# Altium schematic sheet Supplies.SchDoc
size C
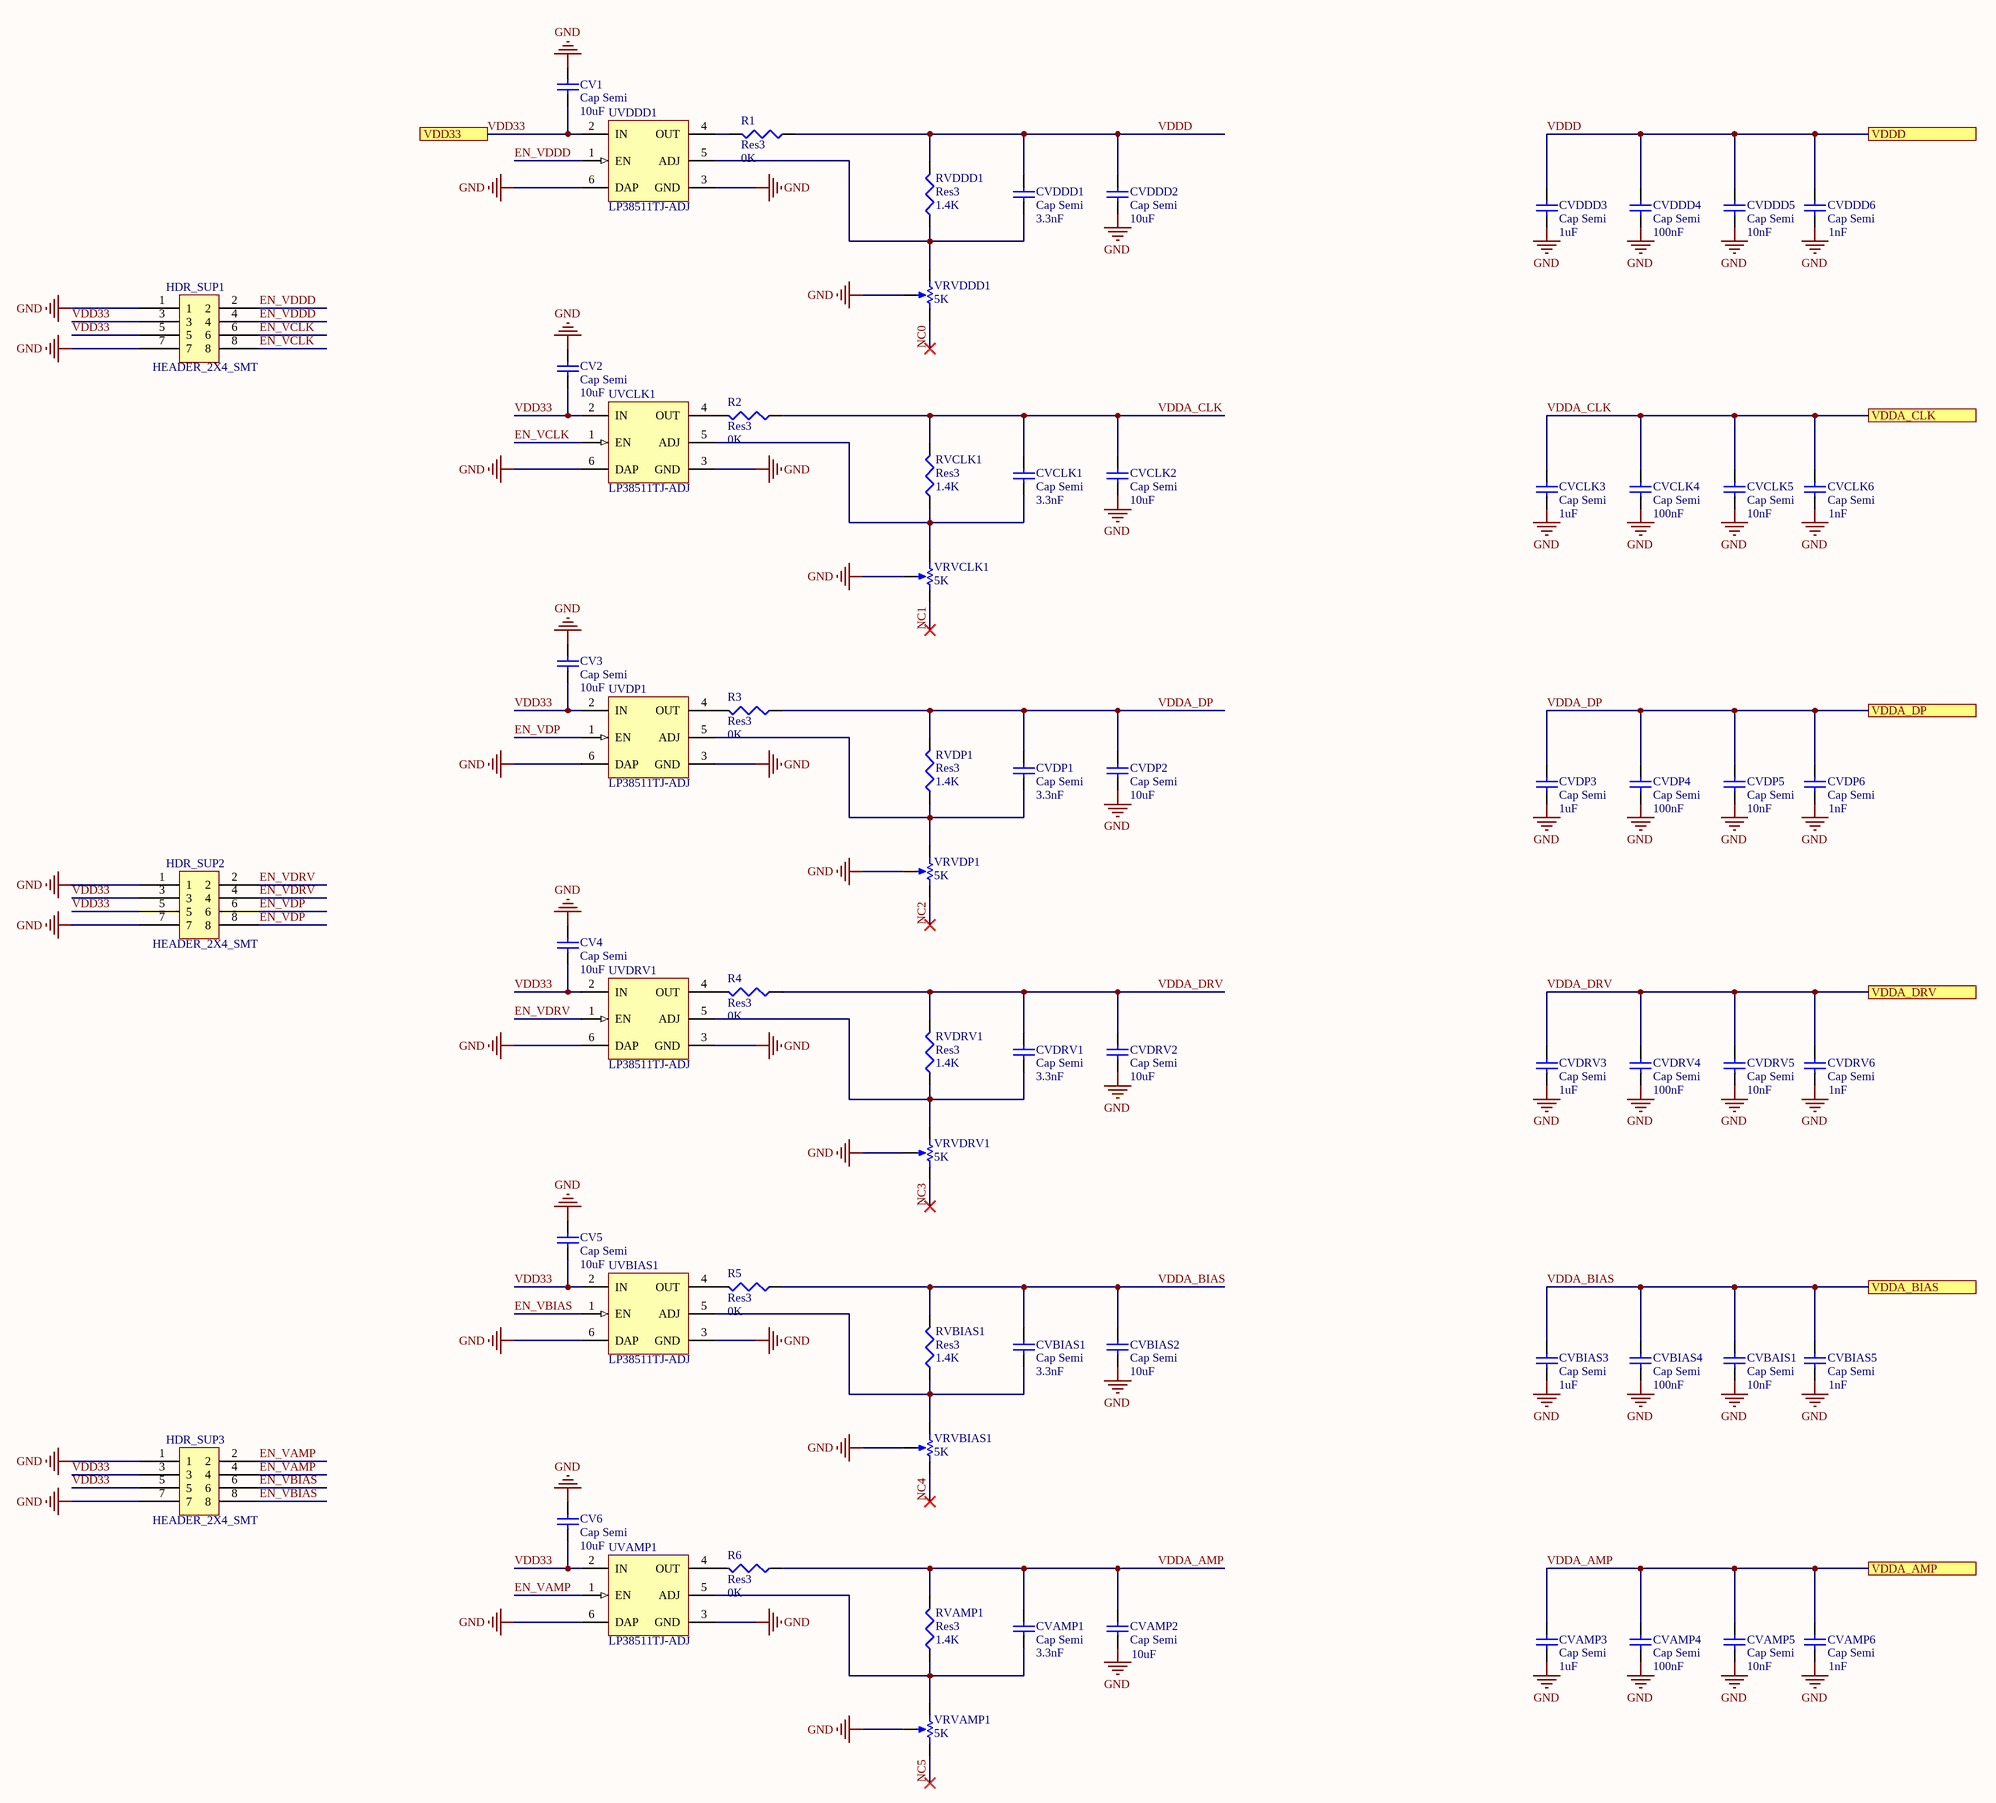
[diagram p0: Supplies.SchDoc]

## Parts
CV1  Cap Semi  value 10uF  [1608[0603]]
CV2  Cap Semi  value 10uF  [1608[0603]]
CV3  Cap Semi  value 10uF  [1608[0603]]
CV4  Cap Semi  value 10uF  [1608[0603]]
CV5  Cap Semi  value 10uF  [1608[0603]]
CV6  Cap Semi  value 10uF  [1608[0603]]
CVAMP1  Cap Semi  value 3.3nF  [1608[0603]]
CVAMP2  Cap Semi  value 10uF  [1608[0603]]
CVAMP3  Cap Semi  value 1uF  [1608[0603]]
CVAMP4  Cap Semi  value 100nF  [1608[0603]]
CVAMP5  Cap Semi  value 10nF  [1608[0603]]
CVAMP6  Cap Semi  value 1nF  [1608[0603]]
CVBAIS1  Cap Semi  value 10nF  [1608[0603]]
CVBIAS1  Cap Semi  value 3.3nF  [1608[0603]]
CVBIAS2  Cap Semi  value 10uF  [1608[0603]]
CVBIAS3  Cap Semi  value 1uF  [1608[0603]]
CVBIAS4  Cap Semi  value 100nF  [1608[0603]]
CVBIAS5  Cap Semi  value 1nF  [1608[0603]]
CVCLK1  Cap Semi  value 3.3nF  [1608[0603]]
CVCLK2  Cap Semi  value 10uF  [1608[0603]]
CVCLK3  Cap Semi  value 1uF  [1608[0603]]
CVCLK4  Cap Semi  value 100nF  [1608[0603]]
CVCLK5  Cap Semi  value 10nF  [1608[0603]]
CVCLK6  Cap Semi  value 1nF  [1608[0603]]
CVDDD1  Cap Semi  value 3.3nF  [1608[0603]]
CVDDD2  Cap Semi  value 10uF  [1608[0603]]
CVDDD3  Cap Semi  value 1uF  [1608[0603]]
CVDDD4  Cap Semi  value 100nF  [1608[0603]]
CVDDD5  Cap Semi  value 10nF  [1608[0603]]
CVDDD6  Cap Semi  value 1nF  [1608[0603]]
CVDP1  Cap Semi  value 3.3nF  [1608[0603]]
CVDP2  Cap Semi  value 10uF  [1608[0603]]
CVDP3  Cap Semi  value 1uF  [1608[0603]]
CVDP4  Cap Semi  value 100nF  [1608[0603]]
CVDP5  Cap Semi  value 10nF  [1608[0603]]
CVDP6  Cap Semi  value 1nF  [1608[0603]]
CVDRV1  Cap Semi  value 3.3nF  [1608[0603]]
CVDRV2  Cap Semi  value 10uF  [1608[0603]]
CVDRV3  Cap Semi  value 1uF  [1608[0603]]
CVDRV4  Cap Semi  value 100nF  [1608[0603]]
CVDRV5  Cap Semi  value 10nF  [1608[0603]]
CVDRV6  Cap Semi  value 1nF  [1608[0603]]
HDR_SUP1  HEADER_2X4_SMT  [HEADER_2X4_SMT]
HDR_SUP2  HEADER_2X4_SMT  [HEADER_2X4_SMT]
HDR_SUP3  HEADER_2X4_SMT  [HEADER_2X4_SMT]
R1  Res3  value 0K  [J1-0603]
R2  Res3  value 0K  [J1-0603]
R3  Res3  value 0K  [J1-0603]
R4  Res3  value 0K  [J1-0603]
R5  Res3  value 0K  [J1-0603]
R6  Res3  value 0K  [J1-0603]
RVAMP1  Res3  value 1.4K  [J1-0603]
RVBIAS1  Res3  value 1.4K  [J1-0603]
RVCLK1  Res3  value 1.4K  [J1-0603]
RVDDD1  Res3  value 1.4K  [J1-0603]
RVDP1  Res3  value 1.4K  [J1-0603]
RVDRV1  Res3  value 1.4K  [J1-0603]
UVAMP1  LP38511TJ-ADJ  [TJ5A_N]
UVBIAS1  LP38511TJ-ADJ  [TJ5A_N]
UVCLK1  LP38511TJ-ADJ  [TJ5A_N]
UVDDD1  LP38511TJ-ADJ  [TJ5A_N]
UVDP1  LP38511TJ-ADJ  [TJ5A_N]
UVDRV1  LP38511TJ-ADJ  [TJ5A_N]
VRVAMP1  5K  [POT_3214_Top]
VRVBIAS1  5K  [POT_3214_Top]
VRVCLK1  5K  [POT_3214_Top]
VRVDDD1  5K  [POT_3214_Top]
VRVDP1  5K  [POT_3214_Top]
VRVDRV1  5K  [POT_3214_Top]

## Ports
VDD33, VDDA_AMP, VDDA_BIAS, VDDA_CLK, VDDA_DP, VDDA_DRV, VDDD

## Nets
GND: CV1.1 CV2.1 CV3.1 CV4.1 CV5.1 CV6.1 CVAMP2.1 CVAMP3.1 CVAMP4.1 CVAMP5.1 CVAMP6.1 CVBAIS1.1 CVBIAS2.1 CVBIAS3.1 CVBIAS4.1 CVBIAS5.1 CVCLK2.1 CVCLK3.1 CVCLK4.1 CVCLK5.1 CVCLK6.1 CVDDD2.1 CVDDD3.1 CVDDD4.1 CVDDD5.1 CVDDD6.1 CVDP2.1 CVDP3.1 CVDP4.1 CVDP5.1 CVDP6.1 CVDRV2.1 CVDRV3.1 CVDRV4.1 CVDRV5.1 CVDRV6.1 HDR_SUP1.1 HDR_SUP1.7 HDR_SUP2.1 HDR_SUP2.7 HDR_SUP3.1 HDR_SUP3.7 UVAMP1.3(GND) UVAMP1.6(DAP) UVBIAS1.3(GND) UVBIAS1.6(DAP) UVCLK1.3(GND) UVCLK1.6(DAP) UVDDD1.3(GND) UVDDD1.6(DAP) UVDP1.3(GND) UVDP1.6(DAP) UVDRV1.3(GND) UVDRV1.6(DAP) VRVAMP1.2(TAP) VRVBIAS1.2(TAP) VRVCLK1.2(TAP) VRVDDD1.2(TAP) VRVDP1.2(TAP) VRVDRV1.2(TAP)
EN_VAMP: HDR_SUP3.2 HDR_SUP3.4 UVAMP1.1(EN)
EN_VBIAS: HDR_SUP3.6 HDR_SUP3.8 UVBIAS1.1(EN)
EN_VCLK: HDR_SUP1.6 HDR_SUP1.8 UVCLK1.1(EN)
EN_VDDD: HDR_SUP1.2 HDR_SUP1.4 UVDDD1.1(EN)
EN_VDP: HDR_SUP2.6 HDR_SUP2.8 UVDP1.1(EN)
EN_VDRV: HDR_SUP2.2 HDR_SUP2.4 UVDRV1.1(EN)
NC0: VRVDDD1.3(BOT)
NC1: VRVCLK1.3(BOT)
NC2: VRVDP1.3(BOT)
NC3: VRVDRV1.3(BOT)
NC4: VRVBIAS1.3(BOT)
NC5: VRVAMP1.3(BOT)
VDD33: CV1.2 CV2.2 CV3.2 CV4.2 CV5.2 CV6.2 HDR_SUP1.3 HDR_SUP1.5 HDR_SUP2.3 HDR_SUP2.5 HDR_SUP3.3 HDR_SUP3.5 UVAMP1.2(IN) UVBIAS1.2(IN) UVCLK1.2(IN) UVDDD1.2(IN) UVDP1.2(IN) UVDRV1.2(IN) ; port VDD33
VDDA_AMP: CVAMP1.2 CVAMP2.2 CVAMP3.2 CVAMP4.2 CVAMP5.2 CVAMP6.2 R6.1 RVAMP1.2 ; port VDDA_AMP
VDDA_BIAS: CVBAIS1.2 CVBIAS1.2 CVBIAS2.2 CVBIAS3.2 CVBIAS4.2 CVBIAS5.2 R5.1 RVBIAS1.2 ; port VDDA_BIAS
VDDA_CLK: CVCLK1.2 CVCLK2.2 CVCLK3.2 CVCLK4.2 CVCLK5.2 CVCLK6.2 R2.1 RVCLK1.2 ; port VDDA_CLK
VDDA_DP: CVDP1.2 CVDP2.2 CVDP3.2 CVDP4.2 CVDP5.2 CVDP6.2 R3.1 RVDP1.2 ; port VDDA_DP
VDDA_DRV: CVDRV1.2 CVDRV2.2 CVDRV3.2 CVDRV4.2 CVDRV5.2 CVDRV6.2 R4.1 RVDRV1.2 ; port VDDA_DRV
VDDD: CVDDD1.2 CVDDD2.2 CVDDD3.2 CVDDD4.2 CVDDD5.2 CVDDD6.2 R1.1 RVDDD1.2 ; port VDDD
NetCVAMP1_1: CVAMP1.1 RVAMP1.1 UVAMP1.5(ADJ) VRVAMP1.1(TOP)
NetCVBIAS1_1: CVBIAS1.1 RVBIAS1.1 UVBIAS1.5(ADJ) VRVBIAS1.1(TOP)
NetCVCLK1_1: CVCLK1.1 RVCLK1.1 UVCLK1.5(ADJ) VRVCLK1.1(TOP)
NetCVDDD1_1: CVDDD1.1 RVDDD1.1 UVDDD1.5(ADJ) VRVDDD1.1(TOP)
NetCVDP1_1: CVDP1.1 RVDP1.1 UVDP1.5(ADJ) VRVDP1.1(TOP)
NetCVDRV1_1: CVDRV1.1 RVDRV1.1 UVDRV1.5(ADJ) VRVDRV1.1(TOP)
NetR1_2: R1.2 UVDDD1.4(OUT)
NetR2_2: R2.2 UVCLK1.4(OUT)
NetR3_2: R3.2 UVDP1.4(OUT)
NetR4_2: R4.2 UVDRV1.4(OUT)
NetR5_2: R5.2 UVBIAS1.4(OUT)
NetR6_2: R6.2 UVAMP1.4(OUT)

## Notes on the sheet
- Title
- Size:
- Date:
- File:
- C
- Number:
- Time:
- Revision:
- Sheet
- of

## Library data of the parts
CV1-CV6 CVAMP1-CVAMP6 CVBAIS1 CVBIAS1-CVBIAS5 CVCLK1-CVCLK6 CVDDD1-CVDDD6 CVDP1-CVDP6 CVDRV1-CVDRV6 = Cap Semi: Capacitor (Semiconductor SIM Model); Published: 8-Jun-2000; LatestRevisionDate: 29-May-2009; LatestRevisionNote: IPC-7351 Footprint Added.; PackageReference: C1206; Publisher: Altium Limited; PackageDescription: Chip Capacitor
R1-R6 RVAMP1 RVBIAS1 RVCLK1 RVDDD1 RVDP1 RVDRV1 = Res3: Resistor; Published: 8-Jun-2000; LatestRevisionDate: 29-May-2009; LatestRevisionNote: IPC-7351 Footprint Added.; PackageReference: J1-0603; Publisher: Altium Limited; PackageDescription: Chip Resistor
UVAMP1 UVBIAS1 UVCLK1 UVDDD1 UVDP1 UVDRV1 = LP38511TJ-ADJ: 800 mA Fast-Transient Response Low-Dropout Linear Voltage Regulator with Error Flag, 6-pin TO-263 Thin; Manufacturer: National Semiconductor; PackageTopMarking: NSUZXYTTE#*LP38511*TJ-ADJ; PowerWise: N; CompType: LDO IC; High-Reliability: Y; DatasheetVersion: Feb-2009; PackageVersion: revE, Jan-2008; PackageReference: TJ5A; PackageDescription: Thin TO-263, Molded, 9.85 x 10.16 x 2mm Body, 5 Lead, 1.7mm Pitch, Surface Mount; PartNumber: LP38511TJ-ADJ; RoHS: Y; PinCount: 5; ComponentLink1Description: Manufacturer URL; ComponentLink1URL: http://www.national.com/; ComponentLink2Description: LP38511 Datasheet; ComponentLink2URL: http://www.national.com/ds/LP/LP38511-ADJ.pdf; ComponentLink3Description: LP38511 Web Page; ComponentLink3URL: http://www.national.com/pf/LP/LP38511.html; ComponentLink4Description: TJ5A Package Page; ComponentLink4URL: http://www.national.com/packaging/folders/tj5a.html
VRVAMP1 VRVBIAS1 VRVCLK1 VRVDDD1 VRVDP1 VRVDRV1 = RPot_5K: Potentiometer; Manufacturer: Bourns; Manufacturer ID: 3214X-1-502E; Digikey ID: 3214X-1-502ECT-ND